# Altium schematic sheet Motores.SchDoc
size A4; SheetNumber: 4; SheetTotal: 6
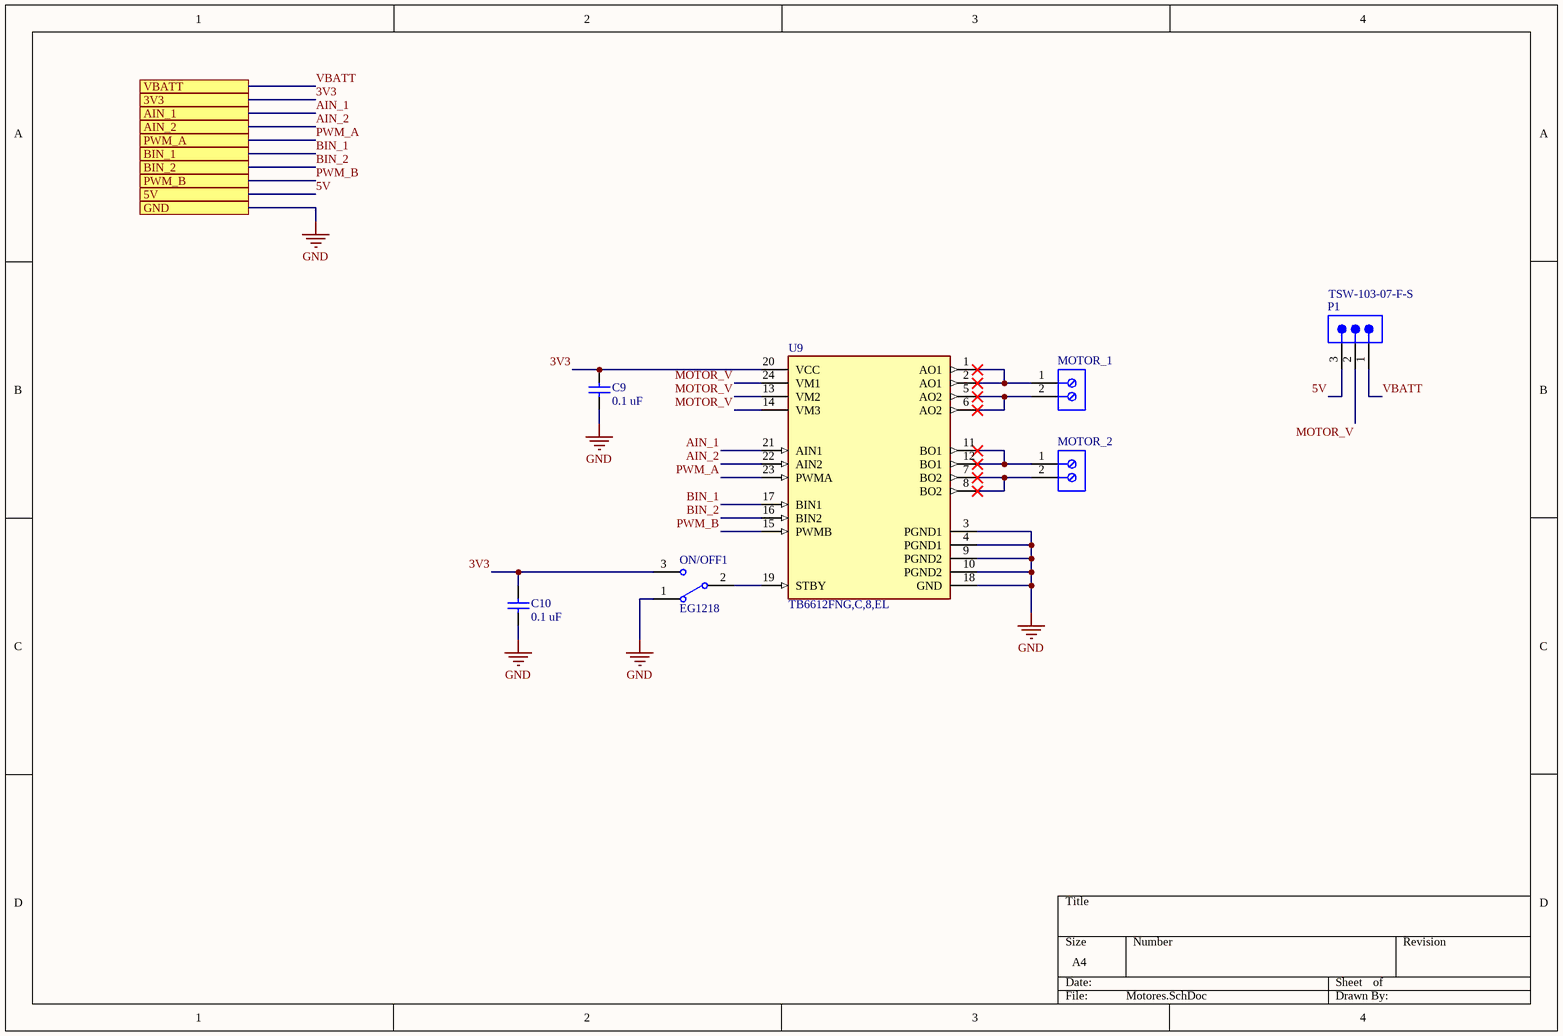
[diagram p0: Motores.SchDoc]

## Parts
C9  0.1 uF  [CAPC2013X94X50ML20T25]
C10  0.1 uF  [CAPC2013X94X50ML20T25]
MOTOR_1  691214110002  [691214110002]  (value not drawn)
MOTOR_2  691214110002  [691214110002]  (value not drawn)
ON/OFF1  EG1218  [ESWI-EG1218_V]
P1  TSW-103-07-F-S  [SMTC-TSW-103-07-X-S]
U9  TB6612FNG,C,8,EL  [FP-SSOP24-P-300-0_65A-IPC_A]

## Ports
3V3, 5V, AIN_1, AIN_2, BIN_1, BIN_2, GND, PWM_A, PWM_B, VBATT

## Nets
GND: C9.1 C10.1 ON/OFF1.1 U9.3(PGND1) U9.4(PGND1) U9.9(PGND2) U9.10(PGND2) U9.18(GND) ; port GND
3V3: C9.2 C10.2 ON/OFF1.3 U9.20(VCC) ; port 3V3
5V: P1.3 ; port 5V
AIN_1: U9.21(AIN1) ; port AIN_1
AIN_2: U9.22(AIN2) ; port AIN_2
BIN_1: U9.17(BIN1) ; port BIN_1
BIN_2: U9.16(BIN2) ; port BIN_2
MOTOR_V: P1.2 U9.13(VM2) U9.14(VM3) U9.24(VM1)
PWM_A: U9.23(PWMA) ; port PWM_A
PWM_B: U9.15(PWMB) ; port PWM_B
VBATT: P1.1 ; port VBATT
NetMOTOR_1_1: MOTOR_1.1 U9.1(AO1) U9.2(AO1)
NetMOTOR_1_2: MOTOR_1.2 U9.5(AO2) U9.6(AO2)
NetMOTOR_2_1: MOTOR_2.1 U9.11(BO1) U9.12(BO1)
NetMOTOR_2_2: MOTOR_2.2 U9.7(BO2) U9.8(BO2)
NetON/OFF1_2: ON/OFF1.2(COM) U9.19(STBY)

## Library data of the parts
C9 C10 = CMP-2000-05016-1: Chip Capacitor, Ceramic, 0.1 uF, 10%, 50 V, 0805, RoHS, Tape and Reel; Manufacturer: AVX; Rated Voltage: 50V; Capacitance: 100nF; Dielectric: X7R; Case Size/Dimension: 0805; Tolerance (%): ±10%; Datasheet URL: http://www.farnell.com/datasheets/319609.pdf; Datasheet Version: Sep-07; Manufacturer URL: http://www.avx.com/
MOTOR_1 MOTOR_2 = CMP-1502-02464-1: Serie 2141 - 3.50 mm Horizontal Entry Modular with Rising Cage Clamp WR-TBL, 2 pin; Manufacturer: Wurth Elektronik; Pin Number: 2; Pitch: 3.50mm; Datasheet URL: http://katalog.we-online.de/em/datasheet/6912141100xx.pdf; Packaging: Box; Mounting Technology: THT; Package Reference: 691214110002; Manufacturer URL: http://www.we-online.de; Part Number: 691214110002; Publisher: WurthElektronik; Operating Temperature: -40to105degC
ON/OFF1 = CMP-1696-00002-1: Slide Switch, 500 V, -20 to 70 degC, 3-Pin THD, RoHS; Case\Package: SOT-23-5; Output Current: 150 mA; Nominal Output Voltage: 3.3 V; Max Power Dissipation: 250 mW; Min Input Voltage: 4.3 V; Outputs: 1; Max Input Voltage: 8 V; Dropout Voltage: 300 mV; PackageDescription: 3-Pin Through Hole Device, Body 11.6 x 4 mm, Pitch 2.5 mm; ComponentLink1URL: http://www.e-switch.ch/en/; RoHSCompliant: true; Length: 3 mm; ComponentLink1Description: Manufacturer URL; Power Rating: 250 mW; Mount: Surface Mount; Max Operating Temperature: 85 degC; REACH SVHC: No SVHC; Radiation Hardening: No; Height: 1.3 mm; Pins: 5; Max Ouput Current: 150 mA; Output Voltage: 3.3 V; Width: 1.8 mm; Package Quantity: 3000; ComponentLink2URL: https://www.e-switch.com/system/asset/product_line/data_sheet/119/EG.pdf; Min Operating Temperature: -40 degC; ComponentLink2Description: Datasheet; DatasheetVersion: Oct-15; PackageReference: EG1218; Packaging: Tape and Reel
P1 = CMP-1024-00331-1: 0.025" SQ Post Header, Through-hole, Vertical, -55 to 125 degC, 2.54 mm Pitch, 3-Pin, Male, RoHS; Manufacturer: Samtec; Pitch: 2.54 mm; DatasheetVersion: F-214; ComponentLink1Description: Manufacturer URL; ComponentLink3URL: http://www.samtec.com/documents/webfiles/cpdf/TSW-XXX-XX-XXX-X-XX-XXX-MKT.pdf; Mounting Technology: Through-hole; PackageDescription: .025[0.64] SQ. Post Terminal Strip Assembly; Temperature Range: -55 to 125 degC; ComponentLink3Description: Package Specification; Orientation: Vertical; PartNumber: TSW-103-07-F-S; RoHS: True; PackageVersion: DM, 8/1988; ComponentLink2Description: Datasheet; ComponentLink1URL: http://www.samtec.com; ComponentLink2URL: http://www.samtec.com/documents/webfiles/pdf/TSW_TH.PDF; PackageReference: TSW-103-07-X-S
U9 = CMP-2100-03693-3: IC MOTOR DRIVER 2.7V-5.5V 24SSOP; Interface: Parallel; Output Current: 1A; Operating Supply Voltage: 3V; Max Supply Voltage: 5.5V; Min Supply Voltage: 2.7V; Number of Outputs: 2; Logic Function: AND; Min Operating Temperature: -20°C; Max Operating Temperature: 85°C; Number of Pins: 24; Package Quantity: 1; Packaging: Tape and Reel; Mount: Surface Mount; Case/Package: SSOP